# Altium schematic sheet SunS_fixture_EGSE_AVR.SchDoc: Connectors
size A3; Author: Michał Gumiela; ProjectName: SunS
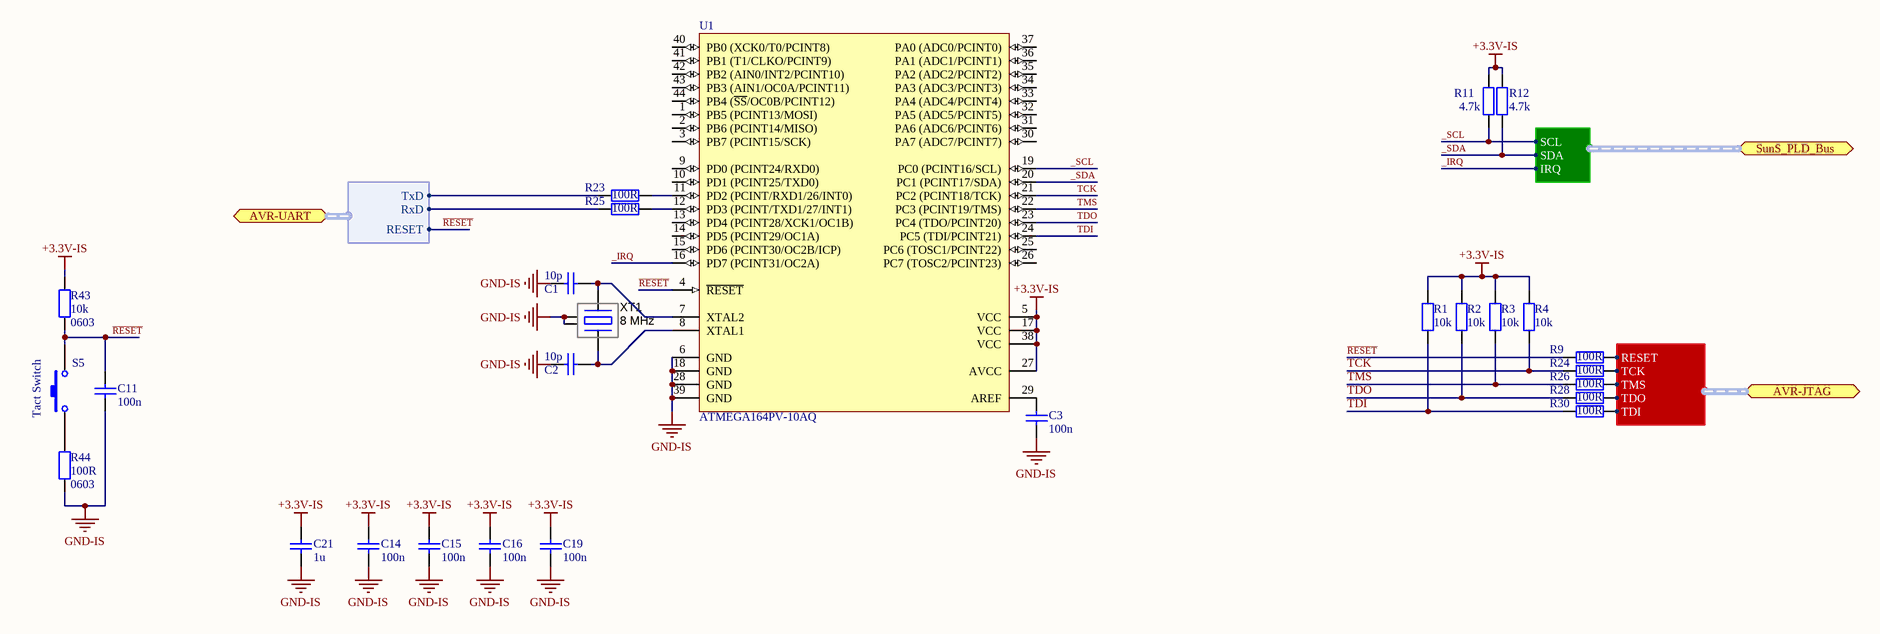
[diagram p0: SunS_fixture_EGSE_AVR.SchDoc]

## Parts
C1  value 10p  [SMD_Capacitor_0603]  (hidden comment: Cap)
C2  value 10p  [SMD_Capacitor_0603]  (hidden comment: Cap)
C3  value 100n  [SMD_Capacitor_0603]  (hidden comment: Cap)
C11  value 100n  [SMD_Capacitor_0603]  (hidden comment: Cap)
C14  value 100n  [SMD_Capacitor_0603]  (hidden comment: Cap)
C15  value 100n  [SMD_Capacitor_0603]  (hidden comment: Cap)
C16  value 100n  [SMD_Capacitor_0603]  (hidden comment: Cap)
C19  value 100n  [SMD_Capacitor_0603]  (hidden comment: Cap)
C21  value 1u  [SMD_Capacitor_1206]  (hidden comment: Cap)
R1  10k  [SMD_Resistor_0603]
R2  10k  [SMD_Resistor_0603]
R3  10k  [SMD_Resistor_0603]
R4  10k  [SMD_Resistor_0603]
R9  100R  [SMD_Resistor_0603]
R11  4.7k  [SMD_Resistor_0603]
R12  4.7k  [SMD_Resistor_0603]
R23  100R  [SMD_Resistor_0603]
R24  100R  [SMD_Resistor_0603]
R25  100R  [SMD_Resistor_0603]
R26  100R  [SMD_Resistor_0603]
R28  100R  [SMD_Resistor_0603]
R30  100R  [SMD_Resistor_0603]
R43  Package: 0603  [SMD_Resistor_0603]  (hidden comment: 10k)
R44  Package: 0603  [SMD_Resistor_0603]  (hidden comment: 100R)
S5  Tact Switch  [Tact Switch 3x6]
U1  ATMEGA164PV-10AQ  [TQFP-44]
XT1  8 MHz  [SMD, 5mm x 3.2mm]

## Ports
AVR-JTAG (harness JTAG), AVR-UART (harness UART), SunS_PLD_Bus (harness SunS_PLD_Bus)

## Harnesses
UART: TxD, RxD, RESET
SunS_PLD_Bus: SCL, SDA, IRQ
JTAG: TDO, TDI, TMS, TCK, RESET

## Nets
+3.3V-IS: C14.1 C15.1 C16.1 C19.1 C21.1 R1.1 R2.2 R3.2 R4.1 R11.1 R12.1 R43.1 U1.5(VCC) U1.17(VCC) U1.27(AVCC) U1.38(VCC)
GND-IS: C1.2 C2.2 C3.2 C11.2 C14.2 C15.2 C16.2 C19.2 C21.2 R44.2 U1.6(GND) U1.18(GND) U1.28(GND) U1.39(GND) XT1.2(GND) XT1.4(GND)
_IRQ: U1.16(PD7_(PCINT31/OC2A)) ; port SunS_PLD_Bus.IRQ
_SCL: R11.2 U1.19(PC0_(PCINT16/SCL)) ; port SunS_PLD_Bus.SCL
_SDA: R12.2 U1.20(PC1_(PCINT17/SDA)) ; port SunS_PLD_Bus.SDA
~{RESET}: C11.1 R9.2 R43.2 S5.2 U1.4(~{RESET}) ; port AVR-UART.RESET
TCK: R4.2 R24.2 U1.21(PC2_(PCINT18/TCK))
TDI: R1.2 R30.2 U1.24(PC5_(TDI/PCINT21))
TDO: R2.1 R28.2 U1.23(PC4_(TDO/PCINT20))
TMS: R3.1 R26.2 U1.22(PC3_(PCINT19/TMS))
NetC1_1: C1.1 U1.7(XTAL2) XT1.1(inp)
NetC2_1: C2.1 U1.8(XTAL1) XT1.3(out)
NetC3_1: C3.1 U1.29(AREF)
NetR9_1: R9.1 ; port AVR-JTAG.RESET
NetR23_1: R23.1 ; port AVR-UART.TxD
NetR23_2: R23.2 U1.11(PD2_(PCINT/RXD1/26/INT0))
NetR24_1: R24.1 ; port AVR-JTAG.TCK
NetR25_1: R25.1 ; port AVR-UART.RxD
NetR25_2: R25.2 U1.12(PD3_(PCINT/TXD1/27/INT1))
NetR26_1: R26.1 ; port AVR-JTAG.TMS
NetR28_1: R28.1 ; port AVR-JTAG.TDO
NetR30_1: R30.1 ; port AVR-JTAG.TDI
NetR44_1: R44.1 S5.1

Not connected (* = marked no-connect by the designer): U1 1(PB5_(PCINT13/MOSI)) 2(PB6_(PCINT14/MISO)) 3(PB7_(PCINT15/SCK)) 9(PD0_(PCINT24/RXD0)) 10(PD1_(PCINT25/TXD0)) 13(PD4_(PCINT28/XCK1/OC1B)) 14(PD5_(PCINT29/OC1A)) 15(PD6_(PCINT30/OC2B/ICP)) 25(PC6_(TOSC1/PCINT22)) 26(PC7_(TOSC2/PCINT23)) 30(PA7_(ADC7/PCINT7)) 31(PA6_(ADC6/PCINT6)) 32(PA5_(ADC5/PCINT5)) 33(PA4_(ADC4/PCINT4)) 34(PA3_(ADC3/PCINT3)) 35(PA2_(ADC2/PCINT2)) 36(PA1_(ADC1/PCINT1)) 37(PA0_(ADC0/PCINT0)) 40(PB0_(XCK0/T0/PCINT8)) 41(PB1_(T1/CLKO/PCINT9)) 42(PB2_(AIN0/INT2/PCINT10)) 43(PB3_(AIN1/OC0A/PCINT11)) 44(PB4_(~{SS}/OC0B/PCINT12))

## Notes on the sheet
- Title:
- Project:
- Author:
- Model:
- Document Number:
- Checked by:
- Rev:
- Date:
- Approved by:
- Sheet:
- of
- File name:

## Library data of the parts
R1-R4 R9 R11 R12 R23-R26 R28 R30 R43 R44 = Res
  R1-R4: Value: 10k; Package: 0402
  R9 R23-R26 R28 R30: Value: 100R; Package: 0603
  R11 R12: Value: 4.7k; Package: 0603
  R43: Value: 10k
  R44: Value: 100R
S5 = TactSwitch: Supplier 1: Farnell
U1 = ATMEGA164PV-10AQ: General-purpose microcontroller; Value: ATMEGA164PV-10AQ
XT1 = ABM3B-8.000MHZ-B2-T: Resonator Ceramic; value: 8 MHz; Manufacturer Part Number: ABM3B-8.000MHZ-B2-T
C1-C3 C11 C14-C16 C19 C21 = Cap: Package: 0603